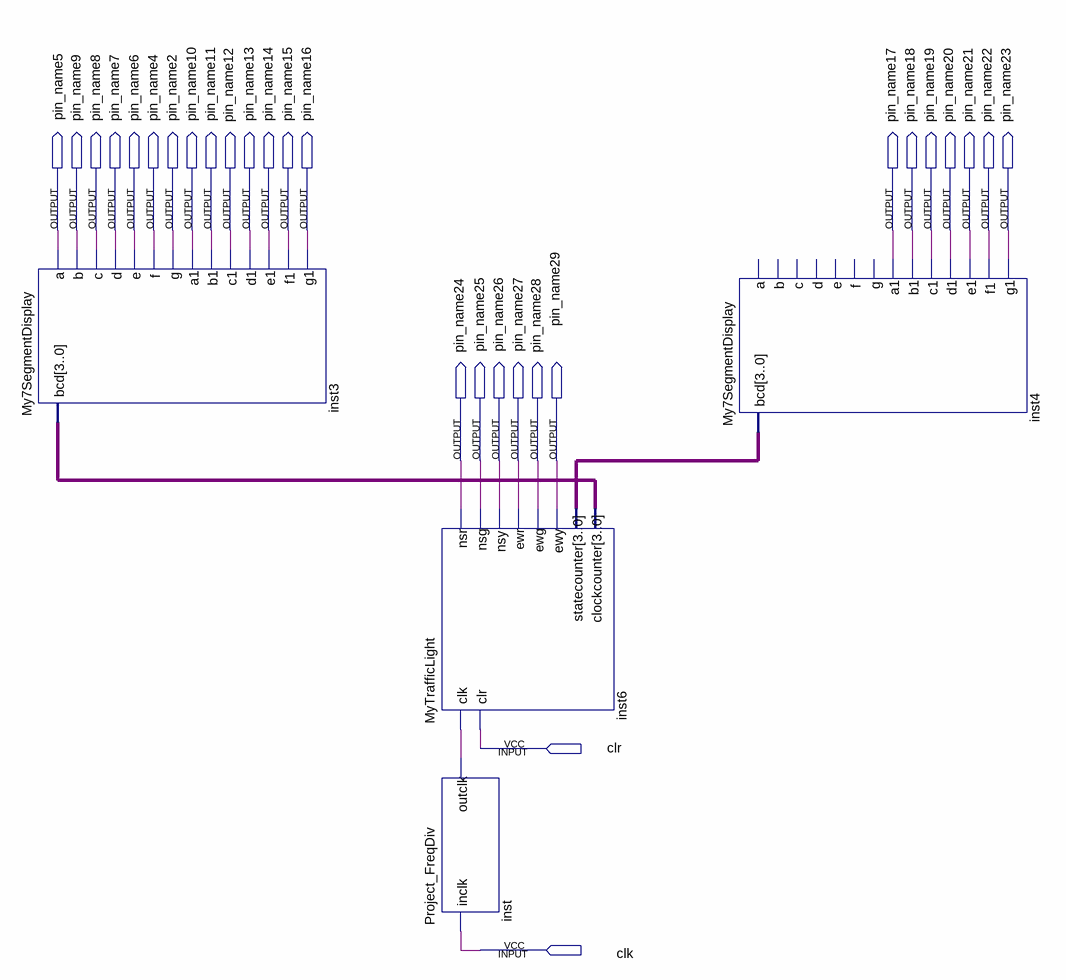
[diagram p0: schematic sheet]
// Quartus schematic MyProject_TrafficLight.bdf as structural Verilog: 4 symbols, 29 pins
module MyProject_TrafficLight (
  input  clr,
  input  clk,
  output pin_name5,
  output pin_name9,
  output pin_name8,
  output pin_name7,
  output pin_name6,
  output pin_name4,
  output pin_name2,
  output pin_name10,
  output pin_name11,
  output pin_name12,
  output pin_name13,
  output pin_name14,
  output pin_name15,
  output pin_name16,
  output pin_name17,
  output pin_name18,
  output pin_name19,
  output pin_name20,
  output pin_name21,
  output pin_name22,
  output pin_name23,
  output pin_name24,
  output pin_name25,
  output pin_name26,
  output pin_name27,
  output pin_name28,
  output pin_name29
);

  wire inst_outclk;
  wire [3:0] inst6_clockcounter, inst6_statecounter;

  My7SegmentDisplay inst3 (
    .bcd(inst6_clockcounter), .a(pin_name5), .b(pin_name9), .c(pin_name8), .d(pin_name7), .e(pin_name6),
    .f(pin_name4), .g(pin_name2), .a1(pin_name10), .b1(pin_name11), .c1(pin_name12), .d1(pin_name13),
    .e1(pin_name14), .f1(pin_name15), .g1(pin_name16));
  MyTrafficLight inst6 (
    .clk(inst_outclk), .clr(clr), .nsr(pin_name24), .nsg(pin_name25), .nsy(pin_name26), .ewr(pin_name27),
    .ewg(pin_name28), .ewy(pin_name29), .statecounter(inst6_statecounter), .clockcounter(inst6_clockcounter));
  Project_FreqDiv inst (.inclk(clk), .outclk(inst_outclk));
  My7SegmentDisplay inst4 (
    .bcd(inst6_statecounter), .a1(pin_name17), .b1(pin_name18), .c1(pin_name19), .d1(pin_name20),
    .e1(pin_name21), .f1(pin_name22), .g1(pin_name23));  // open: a, b, c, d, e, f, g
endmodule
